# Altium schematic sheet SEAx_connector_test.SchDoc
size A3
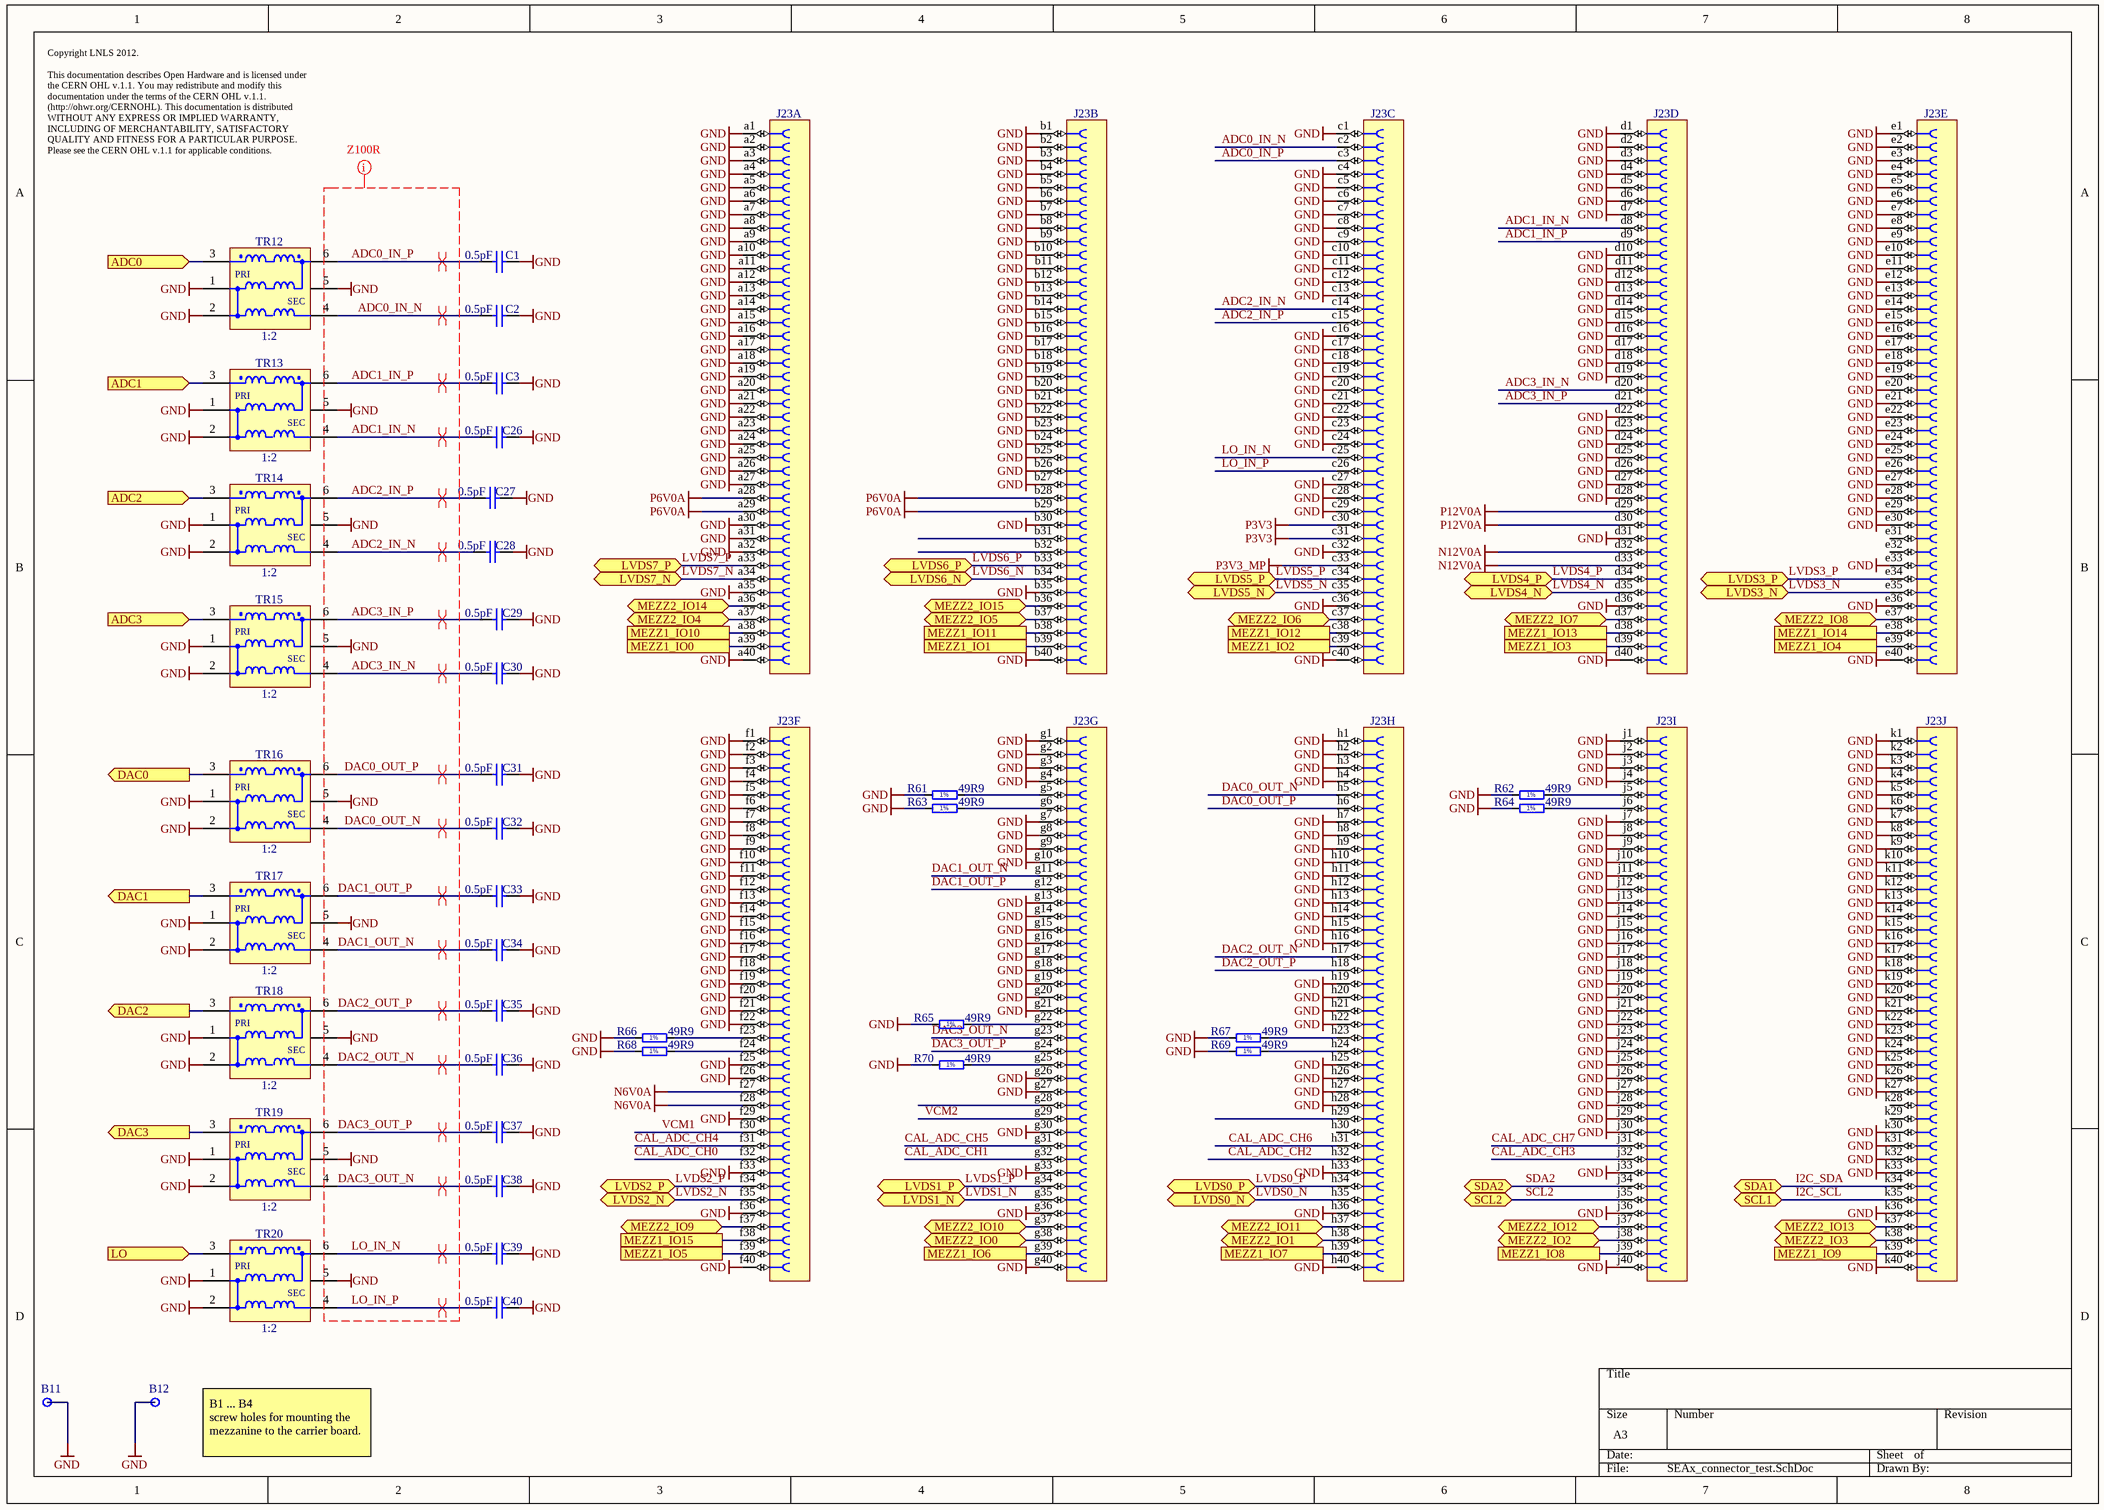
[diagram p0: SEAx_connector_test.SchDoc]

## Parts
B11  Plated Hole  [MTG300_600]  (value not drawn)
B12  Plated Hole  [MTG300_600]  (value not drawn)
C1  0.5pF  [CAPC1005X50N]
C2  0.5pF  [CAPC1005X50N]
C3  0.5pF  [CAPC1005X50N]
C26  0.5pF  [CAPC1005X50N]
C27  0.5pF  [CAPC1005X50N]
C28  0.5pF  [CAPC1005X50N]
C29  0.5pF  [CAPC1005X50N]
C30  0.5pF  [CAPC1005X50N]
C31  0.5pF  [CAPC1005X50N]
C32  0.5pF  [CAPC1005X50N]
C33  0.5pF  [CAPC1005X50N]
C34  0.5pF  [CAPC1005X50N]
C35  0.5pF  [CAPC1005X50N]
C36  0.5pF  [CAPC1005X50N]
C37  0.5pF  [CAPC1005X50N]
C38  0.5pF  [CAPC1005X50N]
C39  0.5pF  [CAPC1005X50N]
C40  0.5pF  [CAPC1005X50N]
J23  VITA 57  [SAMTEC_ASP-134486-01]  (value not drawn)  (parts A,B,C,D,E,F,G,H,I,J of 10)
R61  49R9  [RESC1005X40N]
R62  49R9  [RESC1005X40N]
R63  49R9  [RESC1005X40N]
R64  49R9  [RESC1005X40N]
R65  49R9  [RESC1005X40N]
R66  49R9  [RESC1005X40N]
R67  49R9  [RESC1005X40N]
R68  49R9  [RESC1005X40N]
R69  49R9  [RESC1005X40N]
R70  49R9  [RESC1005X40N]
TR12  1:2  [XFMR_MINI-CIRCUITS_DB1627]
TR13  1:2  [XFMR_MINI-CIRCUITS_DB1627]
TR14  1:2  [XFMR_MINI-CIRCUITS_DB1627]
TR15  1:2  [XFMR_MINI-CIRCUITS_DB1627]
TR16  1:2  [XFMR_MINI-CIRCUITS_DB1627]
TR17  1:2  [XFMR_MINI-CIRCUITS_DB1627]
TR18  1:2  [XFMR_MINI-CIRCUITS_DB1627]
TR19  1:2  [XFMR_MINI-CIRCUITS_DB1627]
TR20  1:2  [XFMR_MINI-CIRCUITS_DB1627]

## Ports
ADC0 (in), ADC1 (in), ADC2 (in), ADC3 (in), DAC0 (out), DAC1 (out), DAC2 (out), DAC3 (out), LO (in), LVDS0_N (bidir), LVDS0_P (bidir), LVDS1_N (bidir), LVDS1_P (bidir), LVDS2_N (bidir), LVDS2_P (bidir), LVDS3_N (bidir), LVDS3_P (bidir), LVDS4_N (bidir), LVDS4_P (bidir), LVDS5_N (bidir), LVDS5_P (bidir), LVDS6_N (bidir), LVDS6_P (bidir), LVDS7_N (bidir), LVDS7_P (bidir), MEZZ1_IO0, MEZZ1_IO1, MEZZ1_IO2, MEZZ1_IO3, MEZZ1_IO4, MEZZ1_IO5, MEZZ1_IO6, MEZZ1_IO7, MEZZ1_IO8, MEZZ1_IO9, MEZZ1_IO10, MEZZ1_IO11, MEZZ1_IO12, MEZZ1_IO13, MEZZ1_IO14, MEZZ1_IO15, MEZZ2_IO0 (bidir), MEZZ2_IO1 (bidir), MEZZ2_IO2 (bidir), MEZZ2_IO3 (bidir), MEZZ2_IO4 (bidir), MEZZ2_IO5 (bidir), MEZZ2_IO6 (bidir), MEZZ2_IO7 (bidir), MEZZ2_IO8 (bidir), MEZZ2_IO9 (bidir), MEZZ2_IO10 (bidir), MEZZ2_IO11 (bidir), MEZZ2_IO12 (bidir), MEZZ2_IO13 (bidir), MEZZ2_IO14 (bidir), MEZZ2_IO15 (bidir), SCL1 (bidir), SCL2 (bidir), SDA1 (bidir), SDA2 (bidir)

## Nets
GND: B11.1 B12.1 C1.2 C2.2 C3.2 C26.2 C27.2 C28.2 C29.2 C30.2 C31.2 C32.2 C33.2 C34.2 C35.2 C36.2 C37.2 C38.2 C39.2 C40.2 J23.a1 J23.a2 J23.a3 J23.a4 J23.a5 J23.a6 J23.a7 J23.a8 J23.a9 J23.a10 J23.a11 J23.a12 J23.a13 J23.a14 J23.a15 J23.a16 J23.a17 J23.a18 J23.a19 J23.a20 J23.a21 J23.a22 J23.a23 J23.a24 J23.a25 J23.a26 J23.a27 J23.a30 J23.a31 J23.a32 J23.a35 J23.a40 J23.b1 J23.b2 J23.b3 J23.b4 J23.b5 J23.b6 J23.b7 J23.b8 J23.b9 J23.b10 J23.b11 J23.b12 J23.b13 J23.b14 J23.b15 J23.b16 J23.b17 J23.b18 J23.b19 J23.b20 J23.b21 J23.b22 J23.b23 J23.b24 J23.b25 J23.b26 J23.b27 J23.b30 J23.b35 J23.b40 J23.c1 J23.c4 J23.c5 J23.c6 J23.c7 J23.c8 J23.c9 J23.c10 J23.c11 J23.c12 J23.c13 J23.c16 J23.c17 J23.c18 J23.c19 J23.c20 J23.c21 J23.c22 J23.c23 J23.c24 J23.c27 J23.c28 J23.c29 J23.c32 J23.c36 J23.c40 J23.d1 J23.d2 J23.d3 J23.d4 J23.d5 J23.d6 J23.d7 J23.d10 J23.d11 J23.d12 J23.d13 J23.d14 J23.d15 J23.d16 J23.d17 J23.d18 J23.d19 J23.d22 J23.d23 J23.d24 J23.d25 J23.d26 J23.d27 J23.d28 J23.d31 J23.d36 J23.d40 J23.e1 J23.e2 J23.e3 J23.e4 J23.e5 J23.e6 J23.e7 J23.e8 J23.e9 J23.e10 J23.e11 J23.e12 J23.e13 J23.e14 J23.e15 J23.e16 J23.e17 J23.e18 J23.e19 J23.e20 J23.e21 J23.e22 J23.e23 J23.e24 J23.e25 J23.e26 J23.e27 J23.e28 J23.e29 J23.e30 J23.e33 J23.e36 J23.e40 J23.f1 J23.f2 J23.f3 J23.f4 J23.f5 J23.f6 J23.f7 J23.f8 J23.f9 J23.f10 J23.f11 J23.f12 J23.f13 J23.f14 J23.f15 J23.f16 J23.f17 J23.f18 J23.f19 J23.f20 J23.f21 J23.f22 J23.f25 J23.f26 J23.f29 J23.f33 J23.f36 J23.f40 J23.g1 J23.g2 J23.g3 J23.g4 J23.g7 J23.g8 J23.g9 J23.g10 J23.g13 J23.g14 J23.g15 J23.g16 J23.g17 J23.g18 J23.g19 J23.g20 J23.g21 J23.g26 J23.g27 J23.g30 J23.g33 J23.g36 J23.g40 J23.h1 J23.h2 J23.h3 J23.h4 J23.h7 J23.h8 J23.h9 J23.h10 J23.h11 J23.h12 J23.h13 J23.h14 J23.h15 J23.h16 J23.h19 J23.h20 J23.h21 J23.h22 J23.h25 J23.h26 J23.h27 J23.h28 J23.h33 J23.h36 J23.h40 J23.j1 J23.j2 J23.j3 J23.j4 J23.j7 J23.j8 J23.j9 J23.j10 J23.j11 J23.j12 J23.j13 J23.j14 J23.j15 J23.j16 J23.j17 J23.j18 J23.j19 J23.j20 J23.j21 J23.j22 J23.j23 J23.j24 J23.j25 J23.j26 J23.j27 J23.j28 J23.j29 J23.j30 J23.j33 J23.j36 J23.j40 J23.k1 J23.k2 J23.k3 J23.k4 J23.k5 J23.k6 J23.k7 J23.k8 J23.k9 J23.k10 J23.k11 J23.k12 J23.k13 J23.k14 J23.k15 J23.k16 J23.k17 J23.k18 J23.k19 J23.k20 J23.k21 J23.k22 J23.k23 J23.k24 J23.k25 J23.k26 J23.k27 J23.k30 J23.k31 J23.k32 J23.k33 J23.k36 J23.k40 R61.1 R62.1 R63.1 R64.1 R65.1 R66.1 R67.1 R68.1 R69.1 R70.1 TR12.1(P1) TR12.2(P1) TR12.5(NC) TR13.1(P1) TR13.2(P1) TR13.5(NC) TR14.1(P1) TR14.2(P1) TR14.5(NC) TR15.1(P1) TR15.2(P1) TR15.5(NC) TR16.1(P1) TR16.2(P1) TR16.5(NC) TR17.1(P1) TR17.2(P1) TR17.5(NC) TR18.1(P1) TR18.2(P1) TR18.5(NC) TR19.1(P1) TR19.2(P1) TR19.5(NC) TR20.1(P1) TR20.2(P1) TR20.5(NC)
N6V0A: J23.f27 J23.f28
N12V0A: J23.d32 J23.d33
P3V3: J23.c30 J23.c31
P3V3_MP: J23.c33
P6V0A: J23.a28 J23.a29 J23.b28 J23.b29
P12V0A: J23.d29 J23.d30
ADC0: TR12.3(P1) ; port ADC0
ADC0_IN_N: C2.1 J23.c2 TR12.4(S1)
ADC0_IN_P: C1.1 J23.c3 TR12.6(S1)
ADC1: TR13.3(P1) ; port ADC1
ADC1_IN_N: C26.1 J23.d8 TR13.4(S1)
ADC1_IN_P: C3.1 J23.d9 TR13.6(S1)
ADC2: TR14.3(P1) ; port ADC2
ADC2_IN_N: C28.1 J23.c14 TR14.4(S1)
ADC2_IN_P: C27.1 J23.c15 TR14.6(S1)
ADC3: TR15.3(P1) ; port ADC3
ADC3_IN_N: C30.1 J23.d20 TR15.4(S1)
ADC3_IN_P: C29.1 J23.d21 TR15.6(S1)
CAL_ADC_CH0: J23.f32
CAL_ADC_CH1: J23.g32
CAL_ADC_CH2: J23.h32
CAL_ADC_CH3: J23.j32
CAL_ADC_CH4: J23.f31
CAL_ADC_CH5: J23.g31
CAL_ADC_CH6: J23.h31
CAL_ADC_CH7: J23.j31
DAC0: TR16.3(P1) ; port DAC0
DAC0_OUT_N: C32.1 J23.h5 TR16.4(S1)
DAC0_OUT_P: C31.1 J23.h6 TR16.6(S1)
DAC1: TR17.3(P1) ; port DAC1
DAC1_OUT_N: C34.1 J23.g11 TR17.4(S1)
DAC1_OUT_P: C33.1 J23.g12 TR17.6(S1)
DAC2: TR18.3(P1) ; port DAC2
DAC2_OUT_N: C36.1 J23.h17 TR18.4(S1)
DAC2_OUT_P: C35.1 J23.h18 TR18.6(S1)
DAC3: TR19.3(P1) ; port DAC3
DAC3_OUT_N: C38.1 J23.g23 TR19.4(S1)
DAC3_OUT_P: C37.1 J23.g24 TR19.6(S1)
I2C_SCL: J23.k35 ; port SCL1
I2C_SDA: J23.k34 ; port SDA1
LO: TR20.3(P1) ; port LO
LO_IN_N: C39.1 J23.c25 TR20.6(S1)
LO_IN_P: C40.1 J23.c26 TR20.4(S1)
LVDS0_N: J23.h35 ; port LVDS0_N
LVDS0_P: J23.h34 ; port LVDS0_P
LVDS1_N: J23.g35 ; port LVDS1_N
LVDS1_P: J23.g34 ; port LVDS1_P
LVDS2_N: J23.f35 ; port LVDS2_N
LVDS2_P: J23.f34 ; port LVDS2_P
LVDS3_N: J23.e35 ; port LVDS3_N
LVDS3_P: J23.e34 ; port LVDS3_P
LVDS4_N: J23.d35 ; port LVDS4_N
LVDS4_P: J23.d34 ; port LVDS4_P
LVDS5_N: J23.c35 ; port LVDS5_N
LVDS5_P: J23.c34 ; port LVDS5_P
LVDS6_N: J23.b34 ; port LVDS6_N
LVDS6_P: J23.b33 ; port LVDS6_P
LVDS7_N: J23.a34 ; port LVDS7_N
LVDS7_P: J23.a33 ; port LVDS7_P
MEZZ1_IO0: J23.a39 ; port MEZZ1_IO0
MEZZ1_IO1: J23.b39 ; port MEZZ1_IO1
MEZZ1_IO2: J23.c39 ; port MEZZ1_IO2
MEZZ1_IO3: J23.d39 ; port MEZZ1_IO3
MEZZ1_IO4: J23.e39 ; port MEZZ1_IO4
MEZZ1_IO5: J23.f39 ; port MEZZ1_IO5
MEZZ1_IO6: J23.g39 ; port MEZZ1_IO6
MEZZ1_IO7: J23.h39 ; port MEZZ1_IO7
MEZZ1_IO8: J23.j39 ; port MEZZ1_IO8
MEZZ1_IO9: J23.k39 ; port MEZZ1_IO9
MEZZ1_IO10: J23.a38 ; port MEZZ1_IO10
MEZZ1_IO11: J23.b38 ; port MEZZ1_IO11
MEZZ1_IO12: J23.c38 ; port MEZZ1_IO12
MEZZ1_IO13: J23.d38 ; port MEZZ1_IO13
MEZZ1_IO14: J23.e38 ; port MEZZ1_IO14
MEZZ1_IO15: J23.f38 ; port MEZZ1_IO15
MEZZ2_IO0: J23.g38 ; port MEZZ2_IO0
MEZZ2_IO1: J23.h38 ; port MEZZ2_IO1
MEZZ2_IO2: J23.j38 ; port MEZZ2_IO2
MEZZ2_IO3: J23.k38 ; port MEZZ2_IO3
MEZZ2_IO4: J23.a37 ; port MEZZ2_IO4
MEZZ2_IO5: J23.b37 ; port MEZZ2_IO5
MEZZ2_IO6: J23.c37 ; port MEZZ2_IO6
MEZZ2_IO7: J23.d37 ; port MEZZ2_IO7
MEZZ2_IO8: J23.e37 ; port MEZZ2_IO8
MEZZ2_IO9: J23.f37 ; port MEZZ2_IO9
MEZZ2_IO10: J23.g37 ; port MEZZ2_IO10
MEZZ2_IO11: J23.h37 ; port MEZZ2_IO11
MEZZ2_IO12: J23.j37 ; port MEZZ2_IO12
MEZZ2_IO13: J23.k37 ; port MEZZ2_IO13
MEZZ2_IO14: J23.a36 ; port MEZZ2_IO14
MEZZ2_IO15: J23.b36 ; port MEZZ2_IO15
SCL2: J23.j35 ; port SCL2
SDA2: J23.j34 ; port SDA2
VCM1: J23.f30
VCM2: J23.g29
NetJ23_f23: J23.f23 R66.2
NetJ23_f24: J23.f24 R68.2
NetJ23_g5: J23.g5 R61.2
NetJ23_g6: J23.g6 R63.2
NetJ23_g22: J23.g22 R65.2
NetJ23_g25: J23.g25 R70.2
NetJ23_h23: J23.h23 R67.2
NetJ23_h24: J23.h24 R69.2
NetJ23_j5: J23.j5 R62.2
NetJ23_j6: J23.j6 R64.2

Not connected (* = marked no-connect by the designer): J23 b31 b32 e31 e32 g28 h29 h30 k28 k29

## Layout directives
differential pair: ADC0_IN_N, ADC0_IN_P, ADC1_IN_N, ADC1_IN_P, ADC2_IN_N, ADC2_IN_P, ADC3_IN_N, ADC3_IN_P, DAC0_OUT_N, DAC0_OUT_P, DAC1_OUT_N, DAC1_OUT_P, DAC2_OUT_N, DAC2_OUT_P, DAC3_OUT_N, DAC3_OUT_P, LO_IN_N, LO_IN_P
rule Differential Pairs Routing [Pref Gap = 12mil    Min Gap  = 12mil    Max Gap  = 12milPref Width = 14mil    Min Width  = 14mil    Max Width  = 14mil]: ADC0_IN_N, ADC0_IN_P, ADC1_IN_N, ADC1_IN_P, ADC2_IN_N, ADC2_IN_P, ADC3_IN_N, ADC3_IN_P, DAC0_OUT_N, DAC0_OUT_P, DAC1_OUT_N, DAC1_OUT_P, DAC2_OUT_N, DAC2_OUT_P, DAC3_OUT_N, DAC3_OUT_P, GND, LO_IN_N, LO_IN_P

## Notes on the sheet
- Copyright LNLS 2012.
  This documentation describes Open Hardware and is licensed under the CERN OHL v.1.1. You may redistribute and modify this documentation under the terms of the CERN OHL v.1.1. (http://ohwr.org/CERNOHL). This documentation is distributed WITHOUT ANY EXPRESS OR IMPLIED WARRANTY, INCLUDING OF MERCHANTABILITY, SATISFACTORY QUALITY AND FITNESS FOR A PARTICULAR PURPOSE. Please see the CERN OHL v.1.1 for applicable conditions.
- (near B12) B1 ... B4
  screw holes for mounting the mezzanine to the carrier board.
- (in symbol R0402_49R9_1%_0.0625W_100PPM) 1%
- (in symbol XFMR_MINI-CIRCUITS_TCM2-43X+) PRI; SEC

## Library data of the parts
B11 B12 = PLATED_HOLE3.0_PAD6.0: Single Terminal Socket; Part Description: Plated Through Hole: Hole Dia.=3.0mm Pad Dia.=6.0mm; Mounted: No; Table: Pads; Part Number: PLATED_HOLE3.0_PAD6.0; Component Kind: Standard (No BOM); Component Type: Standard (No BOM); Designator: Single Terminal Socket; Library Reference: Single Terminal Socket; Pin Count: 1; Family: Plated Hole; Socket: No; SMD: No; Status: None; ComponentHeight: 0mm; Author: CERN DEM JLC; CreateDate: 26.05.2008; LatestRevisionDate: 26.05.2008; PackageDescription: Plated Through Hole: Hole Dia.=3.0mm Pad Dia.=6.0mm
C1-C3 C26-C40 = CC0402_0.5PF_25V_0.05PF_AVX_04023J0R5ABSTR: Non-polarised capacitor; Part Description: Thin-Film Chip Capacitors for RF Signal and Power Applications, Accu-P Series; Manufacturer: AVX; Voltage: 25V; Tolerance: ±0.05pF; Part Number: CC0402_0.5PF_25V_0.05PF_AVX_04023J0R5ABSTR; Component Kind: Standard; Component Type: Standard; Pin Count: 2; Value: 0.5pF; Status: None; Manufacturer Part Number: 04023J0R5ABSTR; Case: 0402; Mounted: Yes; Socket: No; SMD: Yes; Sense: No; ComponentHeight: 0.5mm; HelpURL: \\cern.ch\dfs\Applications\Altium\Datasheets\CC0402_AVX_ACCU-P.pdf; Author: CERN DEM JLC; CreateDate: 22.02.2017; LatestRevisionDate: 22.02.2017
J23 = SAMTEC_ASP-134486-01: Connector VITA 57, 400 Female contacts in 10 row abcdefghj; Part Description: 400 contacts (10 rows abcdefghj) Surface Mount Female Connector, VITA 57 (CC-HPC-10); Manufacturer: SAMTEC; PressFit: No; Part Number: SAMTEC_ASP-134486-01; Component Kind: Standard; Component Type: Standard; Pin Count: 400; Family: VITA 57; Mounted: Yes; Socket: No; SMD: Yes; Status: None; Manufacturer Part Number: ASP-134486-01; ComponentHeight: 6.55mm; HelpURL: \\cern.ch\dfs\Applications\Altium\Datasheets\SAMTEC_ASP-134486-01.pdf; Author: CERN DEM JLC; CreateDate: 30.04.2009; LatestRevisionDate: 17.08.2009; Sense: No
R61-R70 = R0402_49R9_1%_0.0625W_100PPM: Resistor - 1%; Part Description: General Purpose Thick Film Chip Resistor; Manufacturer: GENERIC; Manufacturer1 Part Number: 232270674999L or RC0402FR-0749R9L; TC: ±100ppm/°C; PressFit: No; Part Number: R0402_49R9_1%_0.0625W_100PPM; Component Kind: Standard; Component Type: Standard; Pin Count: 2; Value: 49R9; Status: Not Recommended; Power: 0.0625W; Tolerance: ±1%; Manufacturer Part Number: R0402_49R9_1%_0.0625W_100PPM; Case: 0402; Mounted: Yes; Sense: No; Socket: No; SMD: Yes; Manufacturer1 Example: YAGEO PHYCOMP; Manufacturer1 ComponentHeight: 0.4mm; HelpURL: \\cern.ch\dfs\Applications\Altium\Datasheets\R0402_Phycomp_RC0402.pdf; Author: CERN DEM JLC; CreateDate: 24.10.2012; LatestRevisionDate: 24.10.2012
TR12-TR20 = XFMR_MINI-CIRCUITS_TCM2-43X+: 50 OHMS 10 to 4000 MHz RF Transformer; Power: 0.4W; Part Number: XFMR_MINI-CIRCUITS_TCM2-43X+; Component Kind: Standard; Component Type: Standard; Pin Count: 6; Value: 1:2; Status: None; Part Description: 50 Ohms 10 to 4000MHz RF Transformer; Manufacturer: MINI-CIRCUITS; Manufacturer Part Number: TCM2-43X+; Mounted: Yes; Socket: No; Sense: No; SMD: Yes; ComponentHeight: 4.06mm; HelpURL: \\cern.ch\dfs\Applications\Altium\Datasheets\XFMR_MINI-CIRCUITS_TCM2-43X+.pdf; Author: CERN DEM BC; CreateDate: 12.02.2016; LatestRevisionDate: 12.02.2016